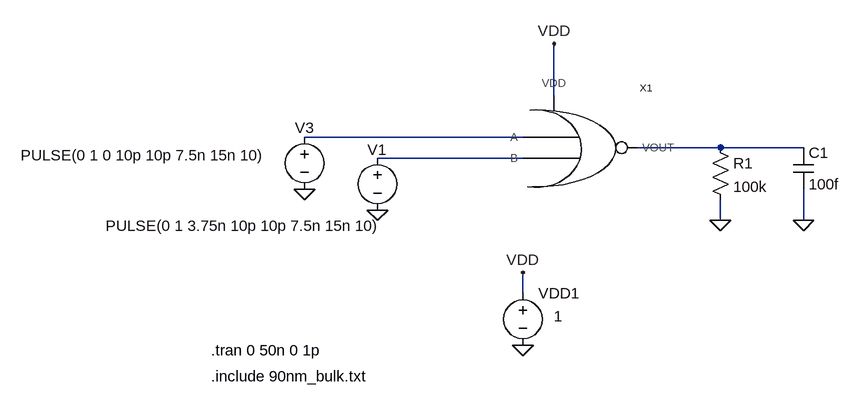
[diagram p0: schematic NOR_test.asc]
NOR_test.asc, the LTspice schematic file:
Version 4
SHEET 1 880 680
WIRE 160 96 160 16
WIRE 112 160 -224 160
WIRE 416 176 288 176
WIRE 544 176 416 176
WIRE 112 192 -112 192
WIRE 416 288 416 256
WIRE 544 288 544 240
WIRE 112 400 112 368
FLAG 416 288 0
FLAG 544 288 0
FLAG 112 480 0
FLAG -112 272 0
FLAG -224 240 0
FLAG 160 16 VDD
FLAG 112 368 VDD
SYMBOL NOR 112 176 R0
SYMATTR InstName X1
SYMBOL voltage -112 176 R0
WINDOW 0 -15 3 Left 2
WINDOW 3 -418 120 Left 2
WINDOW 123 0 0 Left 0
WINDOW 39 0 0 Left 0
SYMATTR InstName V1
SYMATTR Value PULSE(0 1 3.75n 10p 10p 7.5n 15n 10)
SYMBOL res 400 160 R0
SYMATTR InstName R1
SYMATTR Value 100k
SYMBOL cap 528 176 R0
SYMATTR InstName C1
SYMATTR Value 100f
SYMBOL voltage 112 384 R0
WINDOW 3 48 51 Left 2
WINDOW 123 0 0 Left 0
WINDOW 39 0 0 Left 0
SYMATTR Value 1
SYMATTR InstName VDD1
SYMBOL voltage -224 144 R0
WINDOW 0 -15 1 Left 2
WINDOW 3 -437 44 Left 2
WINDOW 123 0 0 Left 0
WINDOW 39 0 0 Left 0
SYMATTR InstName V3
SYMATTR Value PULSE(0 1 0 10p 10p 7.5n 15n 10)
TEXT -368 528 Left 2 !.include 90nm_bulk.txt
TEXT -368 488 Left 2 !.tran 0 50n 0 1p

The netlist it stands for:
* NOR_test.asc
XX1 N001 N003 N002 VDD NOR  ; pins A B VOUT VDD
V1 N003 0 PULSE(0 1 3.75n 10p 10p 7.5n 15n 10)
R1 N002 0 100k
C1 N002 0 100f
VDD1 VDD 0 1
V3 N001 0 PULSE(0 1 0 10p 10p 7.5n 15n 10)
.include 90nm_bulk.txt
.tran 0 50n 0 1p
.backanno
.end